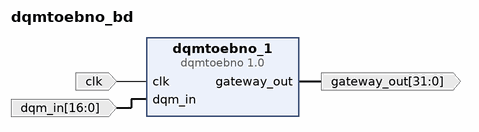
[diagram p0: block diagram of the top level]
# Vivado block design dqmtoebno_bd, xc7k325tfbg676-3, Vivado 2017.2.1
create_bd_design dqmtoebno_bd

create_bd_port -dir I -type clk clk
create_bd_port -dir I -from 16 -to 0 -type data dqm_in
create_bd_port -dir O -from 31 -to 0 -type data gateway_out

create_bd_cell -type ip -vlnv User_Company:SysGen:dqmtoebno:1.0 dqmtoebno_1

# ---- connections ----

connect_bd_net [get_bd_ports clk] [get_bd_pins dqmtoebno_1/clk]
connect_bd_net [get_bd_ports dqm_in] [get_bd_pins dqmtoebno_1/dqm_in]
connect_bd_net [get_bd_pins dqmtoebno_1/gateway_out] [get_bd_ports gateway_out]

validate_bd_design
save_bd_design
